# EAGLE design Schematic (EAGLE 7.6.0)
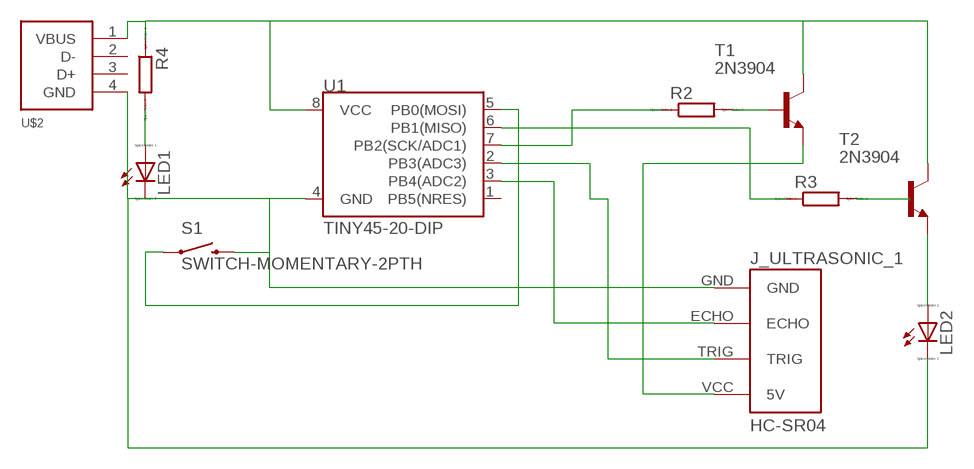
[diagram p0: schematic, sheet 1]

## Parts
J_ULTRASONIC_1  HC-SR04  [HC-SR04_FOOTPRINT]
LED1  LED_ELD260  [LED_LD260]
LED2  LED_ELD260  [LED_LD260]
R2  RR1206  [R1206]
R3  RR1206  [R1206]
R4  RR1206  [R1206]
S1  SWITCH-MOMENTARY-2PTH  [TACTILE-PTH]
T1  2N3904  [TO92]
T2  2N3904  [TO92]
U1  TINY45-20-DIP  ATTINY45TINY45-20-DIP  [DIP08]
U$2  USB-CON-4PIN  [USB-MALE-A-PCB]

## Nets
N$1: R2.1 U1.7(PB2(SCK/ADC1))
N$2: R3.1 U1.6(PB1(MISO))
N$3: LED2.A T2.3(E)
N$4: R4.1 T1.1(C) T2.1(C) U1.8(VCC) U$2.1(VBUS)
N$5: R2.2 T1.2(B)
N$6: R3.2 T2.2(B)
N$7: J_ULTRASONIC_1.GND LED1.K(C) LED2.K(C) S1.3 U1.4(GND) U$2.4(GND)
N$8: J_ULTRASONIC_1.ECHO U1.3(PB4(ADC2))
N$9: J_ULTRASONIC_1.TRIG U1.2(PB3(ADC3))
N$10: J_ULTRASONIC_1.VCC(5V) T1.3(E)
N$11: S1.1 U1.5(PB0(MOSI))
N$12: LED1.A R4.2
Unconnected: U1.1(PB5(NRES)) U$2.2(D-) U$2.3(D+)

## Library data of the parts
J_ULTRASONIC_1 = Ultrasonic Sensor HC-SR04:HC-SR04: Ultrasonic Sensor HC-SR04
LED1 LED2 = eagle-ltspice:LED_E: LED Source: http://www.osram.convergy.de Source: www.luxeon.com Source: www.kingbright.com; SPICEMODEL: NONE; SPICEPREFIX: D; SPICETYPE: diode
R2-R4 = eagle-ltspice:R: RESISTOR, European symbol; SPICEMODEL: NONE; SPICEPREFIX: R
S1 = SparkFun-Electromechanical:SWITCH-MOMENTARY-2: Various NO switches- pushbuttons, reed, etc; PROD_ID: SWCH-08441
T1 T2 = transistor:2N3904: NPN TRANSISTOR
U1 = SparkFun-DigitalIC:ATTINY45: Atmel 8-pin 2/4/8kB flash uC; PROD_ID: IC-09439
U$2 = GeekAmmo:USB-CON-4PIN: USB Connector 4 Pin - No SHIELD

## Board
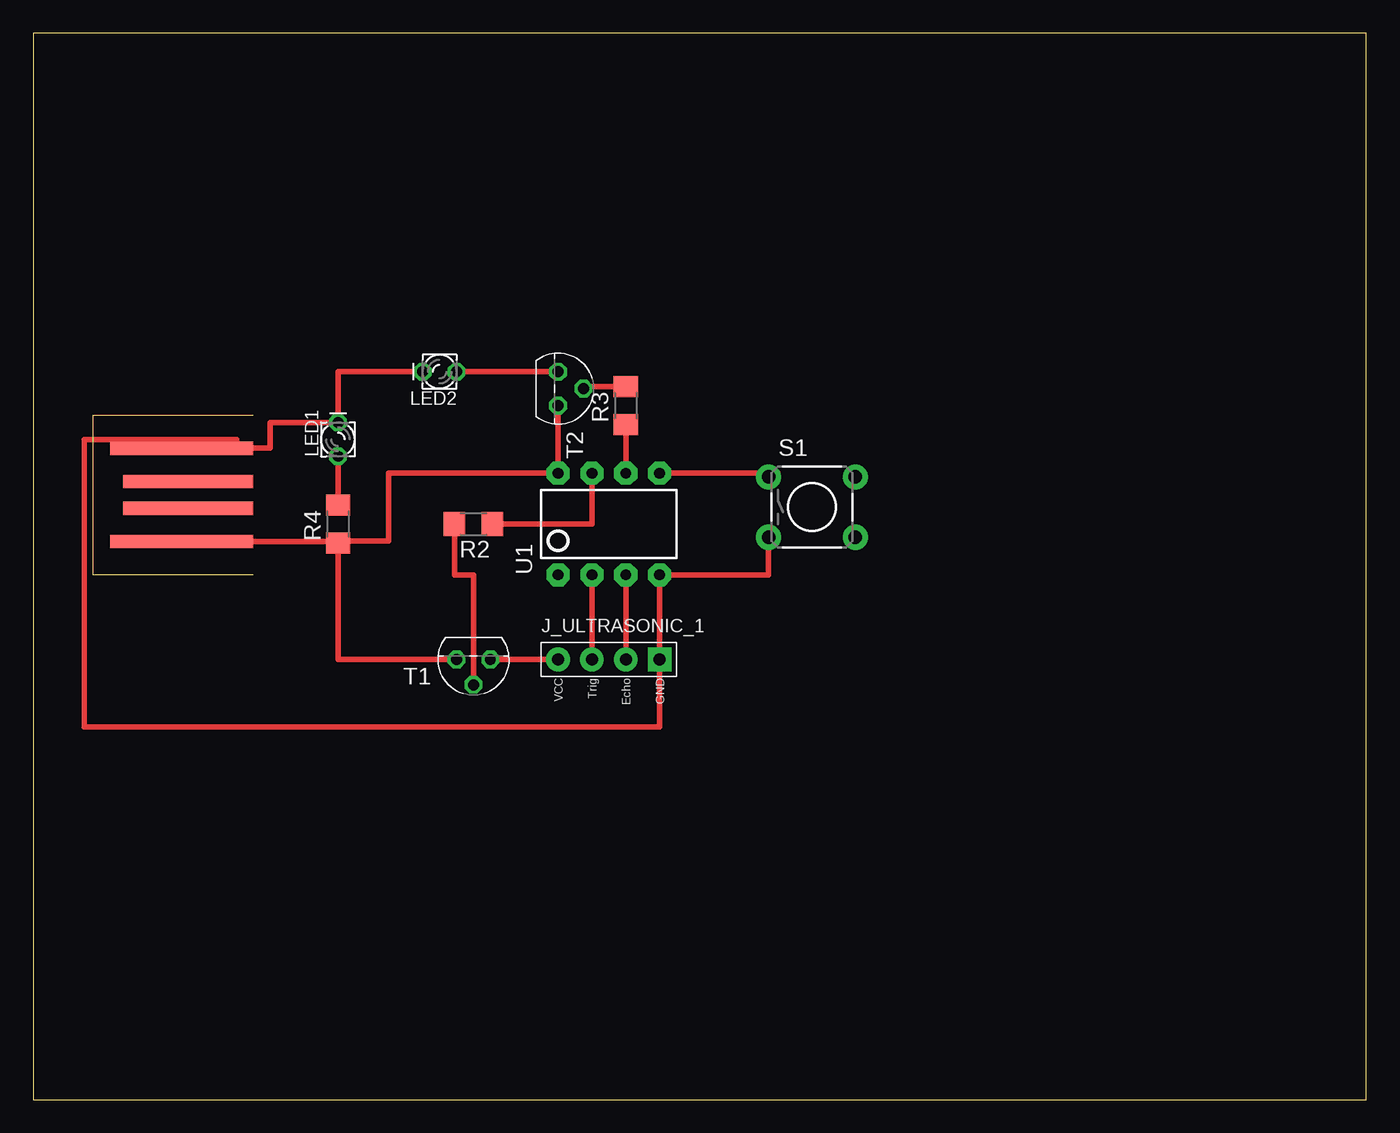
[diagram p1: board, top side]

Size 100 x 80 mm. Coordinates in mm from the lower left corner, seen from the top.
Outline: 0,0 100,0 100,80 0,80 0,0
Copper layers (1*16): Top 0.035mm / dielectric 1.5mm / Bottom 0.035mm
Design rules "default": minimum track width 10mil, minimum drill 24mil, track to track 8mil, track to pad 8mil, pad to pad 8mil, via to via 8mil, smd to smd 8mil, copper to edge 40mil, drill to drill 8mil, minimum pad ring 10mil, minimum via ring 8mil, stop-mask expansion 4mil, vias tented up to drill 0mil, thermal gap 10mil

### Footprints (pad centres in the part's own frame; a part is rotated, then mirrored left to right if it is on the bottom)
HC-SR04_FOOTPRINT = drill 0.9 pad 1.778: ECHO 0,1.27; TRIG 0,-1.27; VCC 0,-3.81 | drill 0.9 pad 1.778 square: GND 0,3.81
LED_LD260 = drill 0.813 octagon: A -1.27,0; K 1.27,0
R1206 = smd 1.6 x 1.803: 1 -1.422,0; 2 1.422,0
TACTILE-PTH = drill 1.016 pad 1.88: 1 -3.251,2.261; 2 3.251,2.261; 3 -3.251,-2.261; 4 3.251,-2.261
TO92 = drill 0.813 octagon: 1 1.27,0; 2 0,1.905; 3 -1.27,0
DIP08 = drill 0.813 pad 1.727 octagon: 1 -3.81,-3.81; 2 -1.27,-3.81; 3 1.27,-3.81; 4 3.81,-3.81; 5 3.81,3.81; 6 1.27,3.81; 7 -1.27,3.81; 8 -3.81,3.81
USB-MALE-A-PCB = smd 1 x 10.76: 1 2.5,5.38; 4 9.5,5.38 | smd 1 x 9.76: 2 5,4.88; 3 7,4.88

### Placement (x,y rotation side)
J_ULTRASONIC_1  43.18,33.02 270 top
LED1  22.86,49.53 90 top
LED2  30.48,54.61 180 top
R2  33.02,43.18 180 top
R3  44.45,52.07 90 top
R4  22.86,43.18 90 top
S1  58.42,44.45 0 top
T1  33.02,33.02 180 top
T2  39.37,53.34 270 top
U1  43.18,43.18 0 top
U$2  16.51,39.37 90 top

### Tracks (layer width: path | path; a pad name or v marks a point on that pad's centre or on a via)
N$1
  Top 0.406: U1.7 41.91,43.18 R2.1
N$2
  Top 0.406: U1.6 R3.1
N$3
  Top 0.406: T2.3 LED2.A
N$4
  Top 0.406: T2.1 U1.8 26.67,46.99 26.67,41.91 22.86,41.91 R4.1 | U$2.1 22.86,41.87 R4.1 | R4.1 22.86,33.02 T1.1
N$5
  Top 0.406: T1.2 33.02,39.37 31.6,39.37 R2.2
N$6
  Top 0.406: R3.2 41.27,53.49 T2.2
N$7
  Top 0.406: S1.3 55.17,39.37 U1.4 J_ULTRASONIC_1.GND 46.99,27.94 3.81,27.94 3.81,49.53 15.24,49.53 15.24,48.87 | U$2.4 15.24,48.87 | 15.24,48.87 17.78,48.87 17.78,50.8 LED1.K 22.86,54.61 LED2.K
N$8
  Top 0.406: J_ULTRASONIC_1.ECHO U1.3
N$9
  Top 0.406: U1.2 J_ULTRASONIC_1.TRIG
N$10
  Top 0.406: J_ULTRASONIC_1.VCC T1.3
N$11
  Top 0.406: S1.1 55.88,46.71 55.88,46.99 U1.5
N$12
  Top 0.406: R4.2 LED1.A